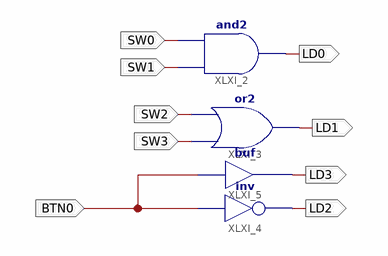
[diagram p0: schematic sheet 1]
// Xilinx ISE schematic swt0.sch (spartan3e) as structural Verilog: 4 symbols, 9 ports
module swt0 (
  input  SW0,
  input  SW1,
  input  SW2,
  input  SW3,
  input  BTN0,
  output LD0,
  output LD1,
  output LD2,
  output LD3
);

  and XLXI_2 (LD0, SW1, SW0);
  or XLXI_3 (LD1, SW3, SW2);
  not XLXI_4 (LD2, BTN0);
  buf XLXI_5 (LD3, BTN0);
endmodule
